# Altium project Base.PrjPCB
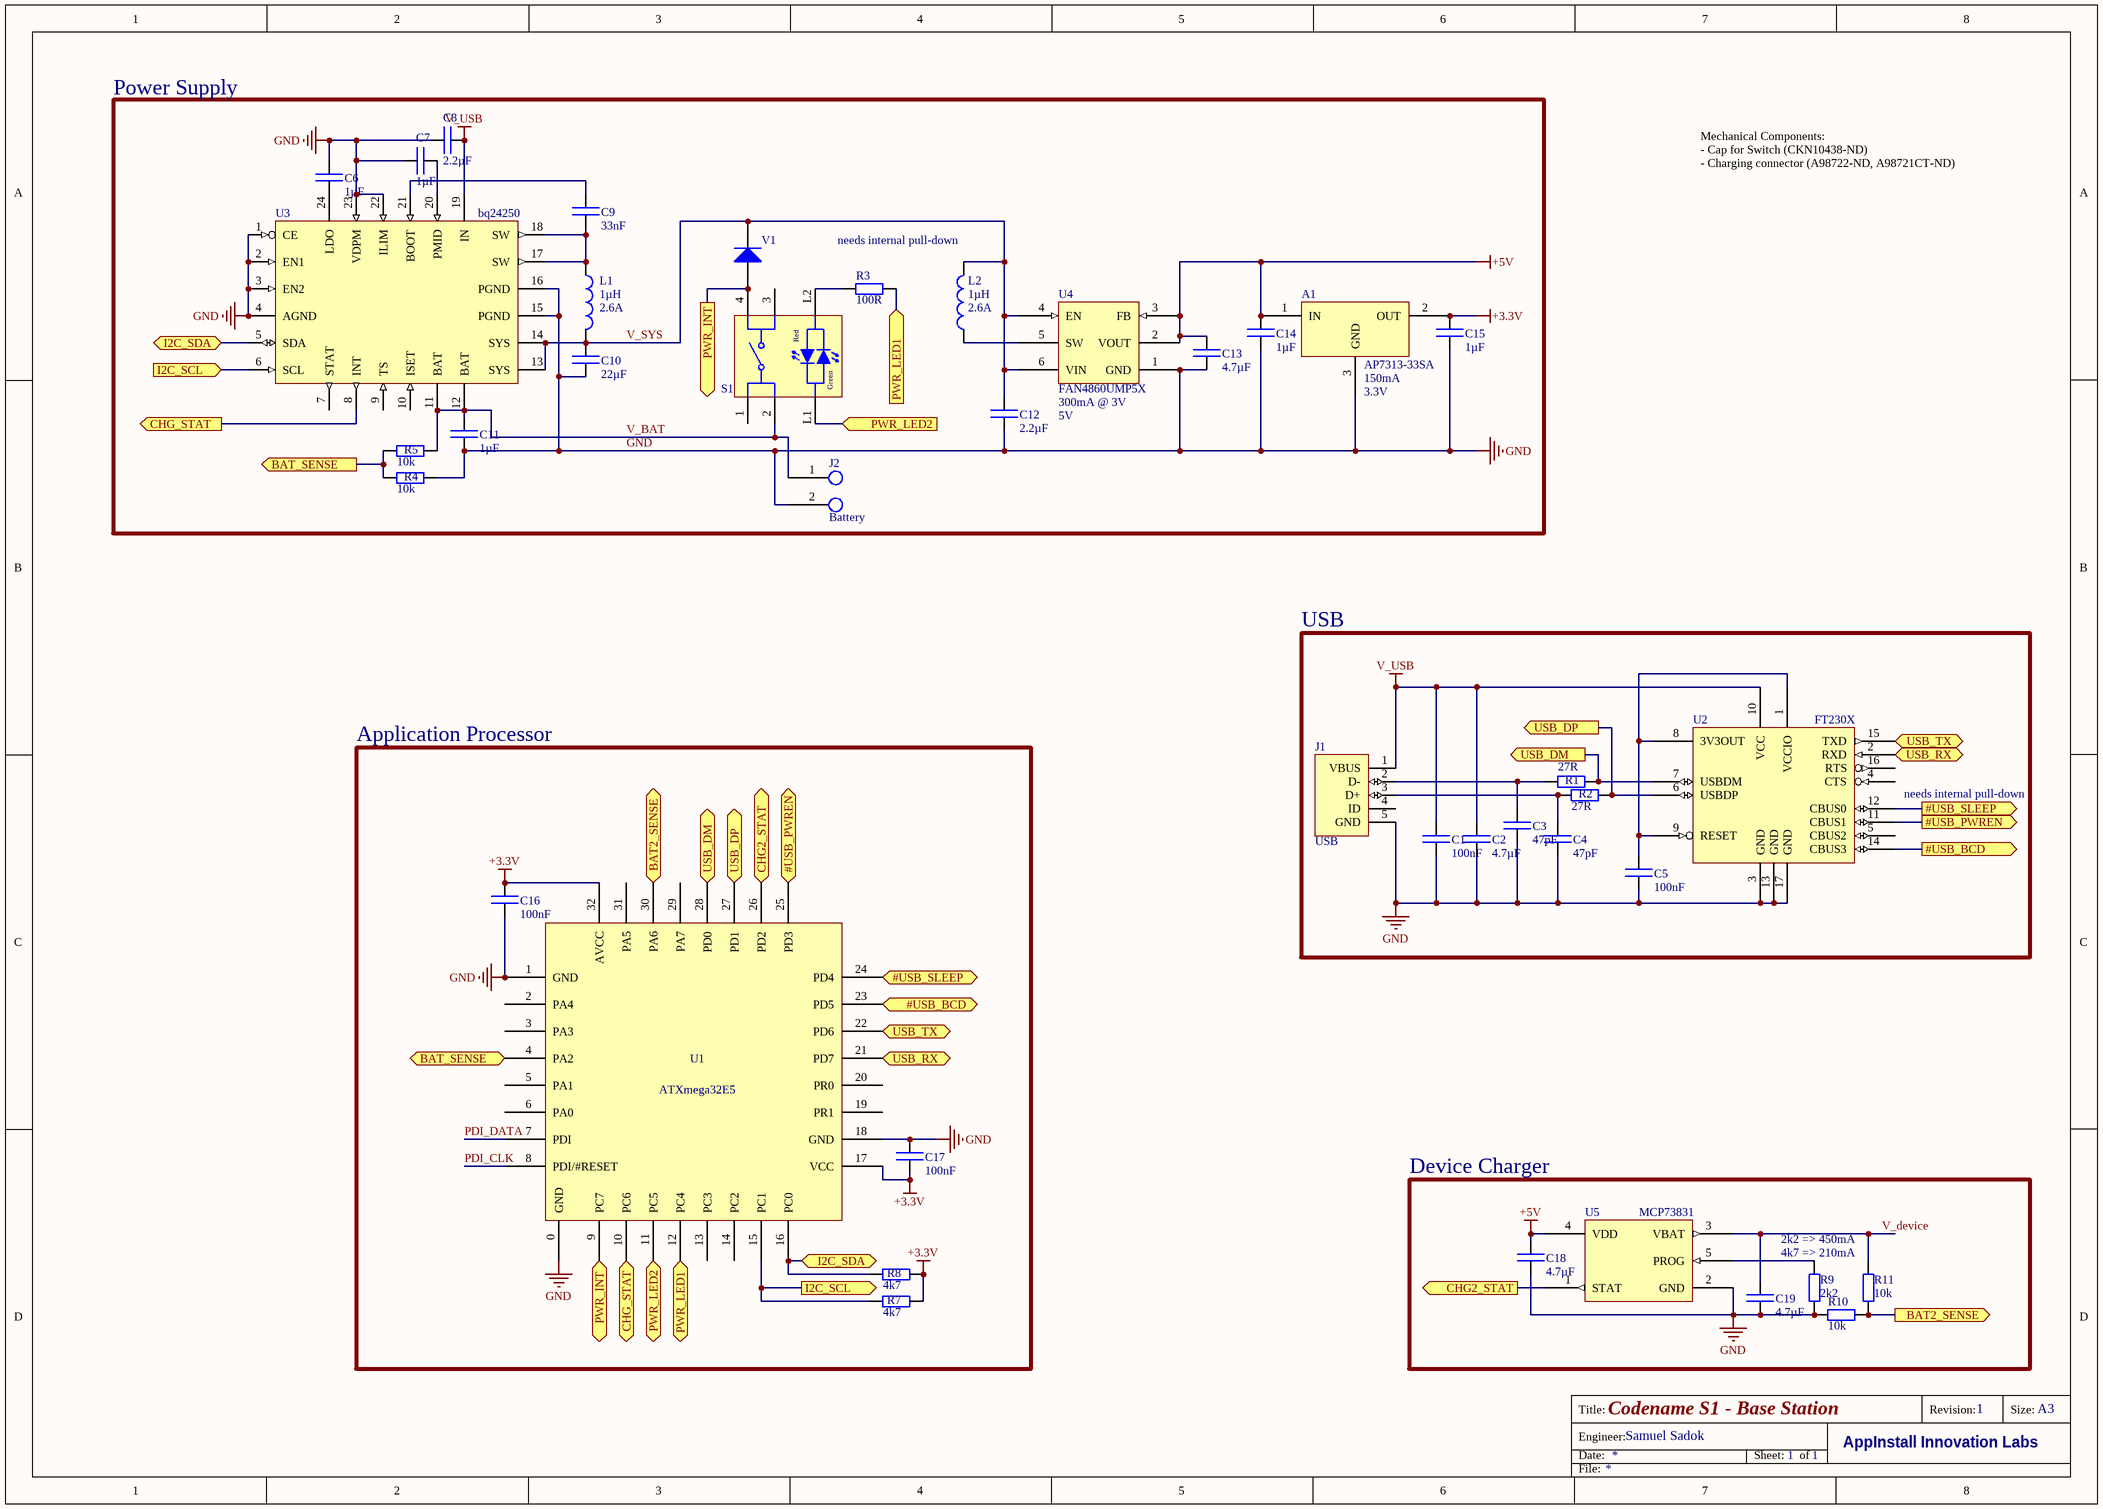
[diagram p0: Base.SchDoc]
1 sheet, 41 parts. Net scope: flat (ports and power ports of the same name join across sheets).
Board file: Base.PcbDoc

## Sheet Base.SchDoc: Codename S1 - Base Station
size A3; Engineer: Samuel Sadok; Revision: 1; SheetNumber: 1; SheetTotal: 1

### Parts
A1  AP7313-33SA  Current: 150mA  Output Voltage: 3.3V  [SOT23]
C1  Capacity: 100nF  [0201 (C)]  (hidden comment: Cap 100nF)
C2  Capacity: 4.7µF  [0402 (C)]  (hidden comment: Cap 4.7µF)
C3  Capacity: 47pF  [0201 (C)]  (hidden comment: Cap 47pF)
C4  Capacity: 47pF  [0201 (C)]  (hidden comment: Cap 47pF)
C5  Capacity: 100nF  [0201 (C)]  (hidden comment: Cap 100nF)
C6  Capacity: 1µF  [0201 (C)]  (hidden comment: Cap 1µF)
C7  Capacity: 1µF  [0201 (C)]  (hidden comment: Cap 1µF)
C8  Capacity: 2.2µF  [0402 (C)]  (hidden comment: Cap 2.2µF)
C9  Capacity: 33nF  [0201 (C)]  (hidden comment: Cap 33nF)
C10  CAPACITY: 22µF  [0805 (C)]  (hidden comment: Cap 22µF)
C11  Capacity: 1µF  [0201 (C)]  (hidden comment: Cap 1µF)
C12  Capacity: 2.2µF  [0402 (C)]  (hidden comment: Cap 2.2µF)
C13  Capacity: 4.7µF  [0402 (C)]  (hidden comment: Cap 4.7µF)
C14  Capacity: 1µF  [0201 (C)]  (hidden comment: Cap 1µF)
C15  Capacity: 1µF  [0201 (C)]  (hidden comment: Cap 1µF)
C16  Capacity: 100nF  [0201 (C)]  (hidden comment: Cap 100nF)
C17  Capacity: 100nF  [0201 (C)]  (hidden comment: Cap 100nF)
C18  Capacity: 4.7µF  [0402 (C)]  (hidden comment: Cap 4.7µF)
C19  Capacity: 4.7µF  [0402 (C)]  (hidden comment: Cap 4.7µF)
J1  USB  [Micro USB Receptacle Vertical]
J2  Battery  [Conn 2-Pos 2.54mm Pitch]
L1  value 1µH  Current: 2.6A  [Inductor 2x2.5mm]  (hidden comment: L 1µH)
L2  value 1µH  Current: 2.6A  [Inductor 2x2.5mm]  (hidden comment: L 1µH)
R1  value 27R  [0201 (R)]  (hidden comment: Res 27R)
R2  value 27R  [0201 (R)]  (hidden comment: Res 27R)
R3  value 100R  [0201 (R)]  (hidden comment: Res 100R)
R4  value 10k  [0201 (R)]  (hidden comment: Res 10k)
R5  value 10k  [0201 (R)]  (hidden comment: Res 10k)
R7  value 4k7  [0201 (R)]  (hidden comment: Res 4k7)
R8  value 4k7  [0201 (R)]  (hidden comment: Res 4k7)
R9  value 2k2  [0201 (R)]  (hidden comment: Res 2k2)
R10  value 10k  [0201 (R)]  (hidden comment: Res 10k)
R11  value 10k  [0201 (R)]  (hidden comment: Res 10k)
S1  ITS13FV1  [Switch Through-Hole]  (value not drawn)
U1  ATXmega32E5  [QFN-32 (5x5mm)]
U2  FT230X  [QFN-16 (4x4mm)]
U3  bq24250  [QFN-24 (4x4mm)]
U4  FAN4860UMP5X  Current: 300mA @ 3V  Output Voltage: 5V  [6-UMLP]
U5  MCP73831  [SOT-23-5]
V1  1N4148W  [SOD923]  (value not drawn)

### Blocks framed on the sheet
Power Supply: A1 C6-C15 J2 L1 L2 R3-R5 S1 U3 U4 V1
USB: C1-C5 J1 R1 R2 U2
Application Processor: C16 C17 R7 R8 U1
Device Charger: C18 C19 R9-R11 U5

### Ports
#USB_BCD (in), #USB_BCD (out), #USB_PWREN (in), #USB_PWREN (out), #USB_SLEEP (in), #USB_SLEEP (out), BAT2_SENSE (in), BAT2_SENSE (out), BAT_SENSE (in), BAT_SENSE (out), CHG2_STAT (in), CHG2_STAT (out), CHG_STAT (in), CHG_STAT (out), I2C_SCL (in), I2C_SCL (out), I2C_SDA (bidir), PWR_INT (in), PWR_INT (out), PWR_LED1 (in), PWR_LED1 (out), PWR_LED2 (in), PWR_LED2 (out), USB_DM (in), USB_DM (out), USB_DP (in), USB_DP (out), USB_RX (in), USB_RX (out), USB_TX (in), USB_TX (out)

### Nets
+3.3V: A1.2(OUT) C15.1 C16.1 C17.2 R7.1 R8.1 U1.17(VCC) U1.32(AVCC)
+5V: A1.1(IN) C13.1 C14.1 C18.1 U4.2(VOUT) U4.3(FB) U5.4(VDD)
GND: A1.3(GND) C1.2 C2.2 C3.2 C4.2 C5.2 C6.1 C7.1 C8.1 C10.2 C11.2 C12.2 C13.2 C14.2 C15.2 C16.2 C17.1 C18.2 C19.2 J1.5(GND) J2.2 R4.1 R9.1 R10.2 U1.0(GND) U1.1(GND) U1.18(GND) U2.3(GND) U2.13(GND) U2.17(GND) U3.1(CE) U3.2(EN1) U3.3(EN2) U3.4(AGND) U3.15(PGND) U3.16(PGND) U3.22(ILIM) U3.23(VDPM) U4.1(GND) U5.2(GND)
V_USB: C1.1 C2.1 C8.2 J1.1(VBUS) U2.10(VCC) U3.19(IN)
PDI_CLK: U1.8(PDI/#RESET)
PDI_DATA: U1.7(PDI)
V_BAT: C11.1 J2.1 R5.2 S1.2 U3.11(BAT) U3.12(BAT)
V_device: C19.1 R11.2 U5.3(VBAT)
V_SYS: C10.1 C12.1 L1.2 L2.2 U3.13(SYS) U3.14(SYS) U4.4(EN) U4.6(VIN) V1.K
NetC3_1: C3.1 J1.2(D-) R1.1
NetC4_1: C4.1 J1.3(D+) R2.1
NetC5_1: C5.1 U2.1(VCCIO) U2.8(3V3OUT) U2.9(RESET)
NetC6_2: C6.2 U3.24(LDO)
NetC7_2: C7.2 U3.20(PMID)
NetC9_1: C9.1 U3.21(BOOT)
NetC9_2: C9.2 L1.1 U3.17(SW) U3.18(SW)
NetL2_1: L2.1 U4.5(SW)
NetR1_2: R1.2 U1.28(PD0) U2.7(USBDM) ; port USB_DM
NetR2_2: R2.2 U1.27(PD1) U2.6(USBDP) ; port USB_DP
NetR3_1: R3.1 S1.L2
NetR3_2: R3.2 U1.12(PC4) ; port PWR_LED1
NetR4_2: R4.2 R5.1 U1.4(PA2) ; port BAT_SENSE
NetR7_2: R7.2 U1.15(PC1) U3.6(SCL) ; port I2C_SCL
NetR8_2: R8.2 U1.16(PC0) U3.5(SDA) ; port I2C_SDA
NetR9_2: R9.2 U5.5(PROG)
NetR10_1: R10.1 R11.1 U1.30(PA6) ; port BAT2_SENSE
NetS1_4: S1.4 U1.9(PC7) V1.A ; port PWR_INT
NetS1_L1: S1.L1 U1.11(PC5) ; port PWR_LED2
NetU1_10: U1.10(PC6) U3.8(INT) ; port CHG_STAT
NetU1_21: U1.21(PD7) U2.2(RXD) ; port USB_RX
NetU1_22: U1.22(PD6) U2.15(TXD) ; port USB_TX
NetU1_23: U1.23(PD5) U2.14(CBUS3) ; port #USB_BCD
NetU1_24: U1.24(PD4) U2.12(CBUS0) ; port #USB_SLEEP
NetU1_25: U1.25(PD3) U2.11(CBUS1) ; port #USB_PWREN
NetU1_26: U1.26(PD2) U5.1(STAT) ; port CHG2_STAT

Not connected (* = marked no-connect by the designer): J1 4(ID); S1 1 3; U1 2(PA4) 3(PA3) 5(PA1) 6(PA0) 13(PC3) 14(PC2) 19(PR1) 20(PR0) 29(PA7) 31(PA5); U2 4(CTS) 5(CBUS2) 16(RTS); U3 7(STAT) 9(TS) 10(ISET)

### Notes on the sheet
- needs internal pull-down
- Mechanical Components:
  - Cap for Switch (CKN10438-ND)
  - Charging connector (A98722-ND, A98721CT-ND)
- (near U2) needs internal pull-down
- 2k2 => 450mA
- 4k7 => 210mA
- Title:
- Date:
- Engineer:
- Sheet:     of
- AppInstall Innovation Labs
- Revision:
- Size:
- A3
- File:
- (in symbol ITS13FV1) Red; Green

### Library data of the parts
A1 = AP7313-33SA: Low Dropout Regulator 3.3V, 150mA; Manufacturer: Diodes Inc.; Input Voltage: 3.5V...6V; Digi-Key: AP7313-33SAG-7DICT-ND
C1 C5 C16 C17 = Cap 100nF: Ceramic Capacitor 100nF; Voltage: 25V
C2 C13 C18 C19 = Cap 4.7µF: Ceramic Capacitor 4.7µF; Voltage: 25V; Supplier 1: Digi-Key; Supplier Part Number 1: 445-3460-1-ND
C3 C4 = Cap 47pF: Ceramic Capacitor 47pF
C6 C7 C11 C14 C15 = Cap 1µF: Ceramic Capacitor 1µF; Voltage: 25V; Supplier 1: Digi-Key; Supplier Part Number 1: 445-1590-1-ND
C8 C12 = Cap 2.2µF: Ceramic Capacitor 2.2µF; Voltage: 25V; Supplier 1: Digi-Key; Supplier Part Number 1: 445-3459-1-ND
C9 = Cap 33nF: Ceramic Capacitor 33nF
C10 = Cap 22µF: Ceramic Capacitor 22µF; VOLTAGE: 35V; Supplier 1: Digi-Key; Supplier Part Number 1: 445-8045-1-ND
J1 = Micro USB: Micro USB Type B Receptacle; Digi-Key (horizontal): 609-4618-1-ND; Digi-Key: WM9734CT-ND
J2 = Connector 2-Pos: Connector 2-Pos 2.54mm Pitch; Digi-Key: WM2711-ND
L1 L2 = L 1µH: Inductor 1µH; Digi-Key: 541-1388-1-ND
R1 R2 = Res 27R: Resistor 27R; Published: 8-Jun-2000; LatestRevisionDate: 17-Jul-2002; LatestRevisionNote: Re-released for DXP Platform.; PackageReference: AXIAL-0.4; Publisher: Altium Limited; PackageDescription: Axial Device, Thru-Hole; 2 Leads; 0.4 in Pin Spacing
R3 = Res 100R: Resistor 100R; Published: 8-Jun-2000; LatestRevisionDate: 17-Jul-2002; LatestRevisionNote: Re-released for DXP Platform.; PackageReference: AXIAL-0.4; Publisher: Altium Limited; PackageDescription: Axial Device, Thru-Hole; 2 Leads; 0.4 in Pin Spacing; Supplier 1: Digi-Key; Supplier Part Number 1: RMCF0805FT100RCT-ND
R4 R5 R10 R11 = Res 10k: Resistor 10k; Published: 8-Jun-2000; LatestRevisionDate: 17-Jul-2002; LatestRevisionNote: Re-released for DXP Platform.; PackageReference: AXIAL-0.4; Publisher: Altium Limited; PackageDescription: Axial Device, Thru-Hole; 2 Leads; 0.4 in Pin Spacing; Supplier 1: Digi-Key; Supplier Part Number 1: RMCF0805FT10K0CT-ND
R7 R8 = Res 4k7: Resistor 4k7; Published: 8-Jun-2000; LatestRevisionDate: 17-Jul-2002; LatestRevisionNote: Re-released for DXP Platform.; PackageReference: AXIAL-0.4; Publisher: Altium Limited; PackageDescription: Axial Device, Thru-Hole; 2 Leads; 0.4 in Pin Spacing; Supplier 1: Digi-Key; Supplier Part Number 1: RMCF0805FT4K70CT-ND
R9 = Res 2k2: Resistor 2k2; Published: 8-Jun-2000; LatestRevisionDate: 17-Jul-2002; LatestRevisionNote: Re-released for DXP Platform.; PackageReference: AXIAL-0.4; Publisher: Altium Limited; PackageDescription: Axial Device, Thru-Hole; 2 Leads; 0.4 in Pin Spacing; Supplier 1: Digi-Key; Supplier Part Number 1: RMCF0805FT2K20CT-ND
S1 = ITS13FV1: Through-Hole Tactile Switch; Cap: 400EB0000; Digi-Key: CKN10442-ND
U1 = Xmega32E5: 8-Bit AVR Microcontroller; Manufacturer: Atmel; Flash: 32kB; RAM: 4kB; EEPROM: 1kB; Speed: 32MHz; Digi-Key: ATXMEGA32E5-MU-ND
U2 = FT230X: USB-UART Bridge; Voltage: 3V...5.5V; I/O Voltage: 1.62V...3.63V; Digi-Key: 768-1130-1-ND
U3 = bq24250: LiPo Chargering Regulator with Step-Down Converter; Max Charging Current: 2A; Digi-Key: 296-36446-1-ND <= wrong!!!
U4 = FAN4860UMP5X: Boost Converter 5V; Compatible Parts: FAN4860UMP5X, TPS61240DRV; Input Voltage: 2.3V...4.5V; Digi-Key: FAN4860UMP5XCT-ND
U5 = MCP73831: 500mA Linear LiPo Charger; Compatible Parts: MCP73831-2ATI/OT, MCP73832-2ATI/OT, MCP73831T-2ATI/OT, MCP73832T-2ATI/OT,; Manufacturer: Microchip; Regaulation Voltage: 4.2V; Note: not RoHS compliant; Current: 500mA; Digi-Key: MCP73831T-2ATI/OTCT-ND
V1 = Diode: Forward Voltage: 1.25V; Current: 150mA; Digi-Key: BAS16SLCT-ND